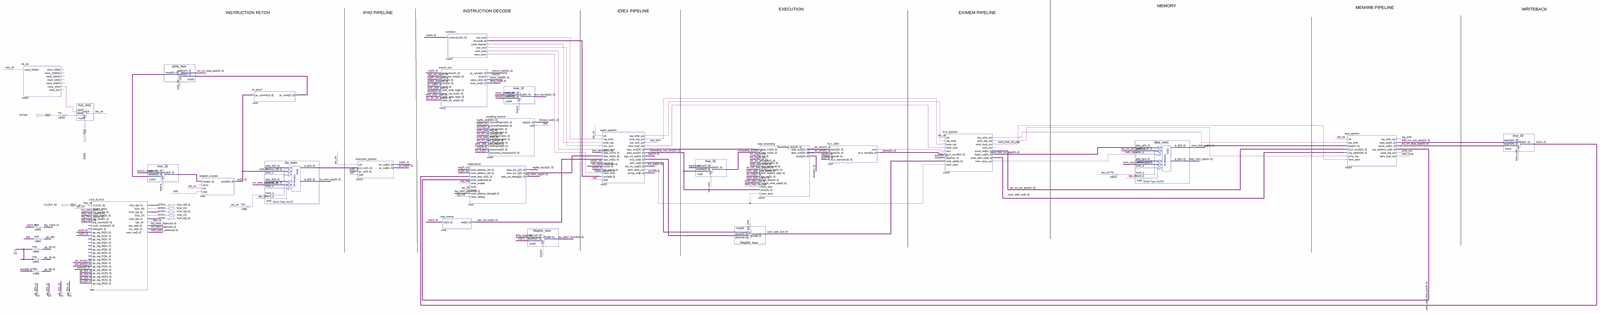
[diagram p0: schematic sheet, whole]
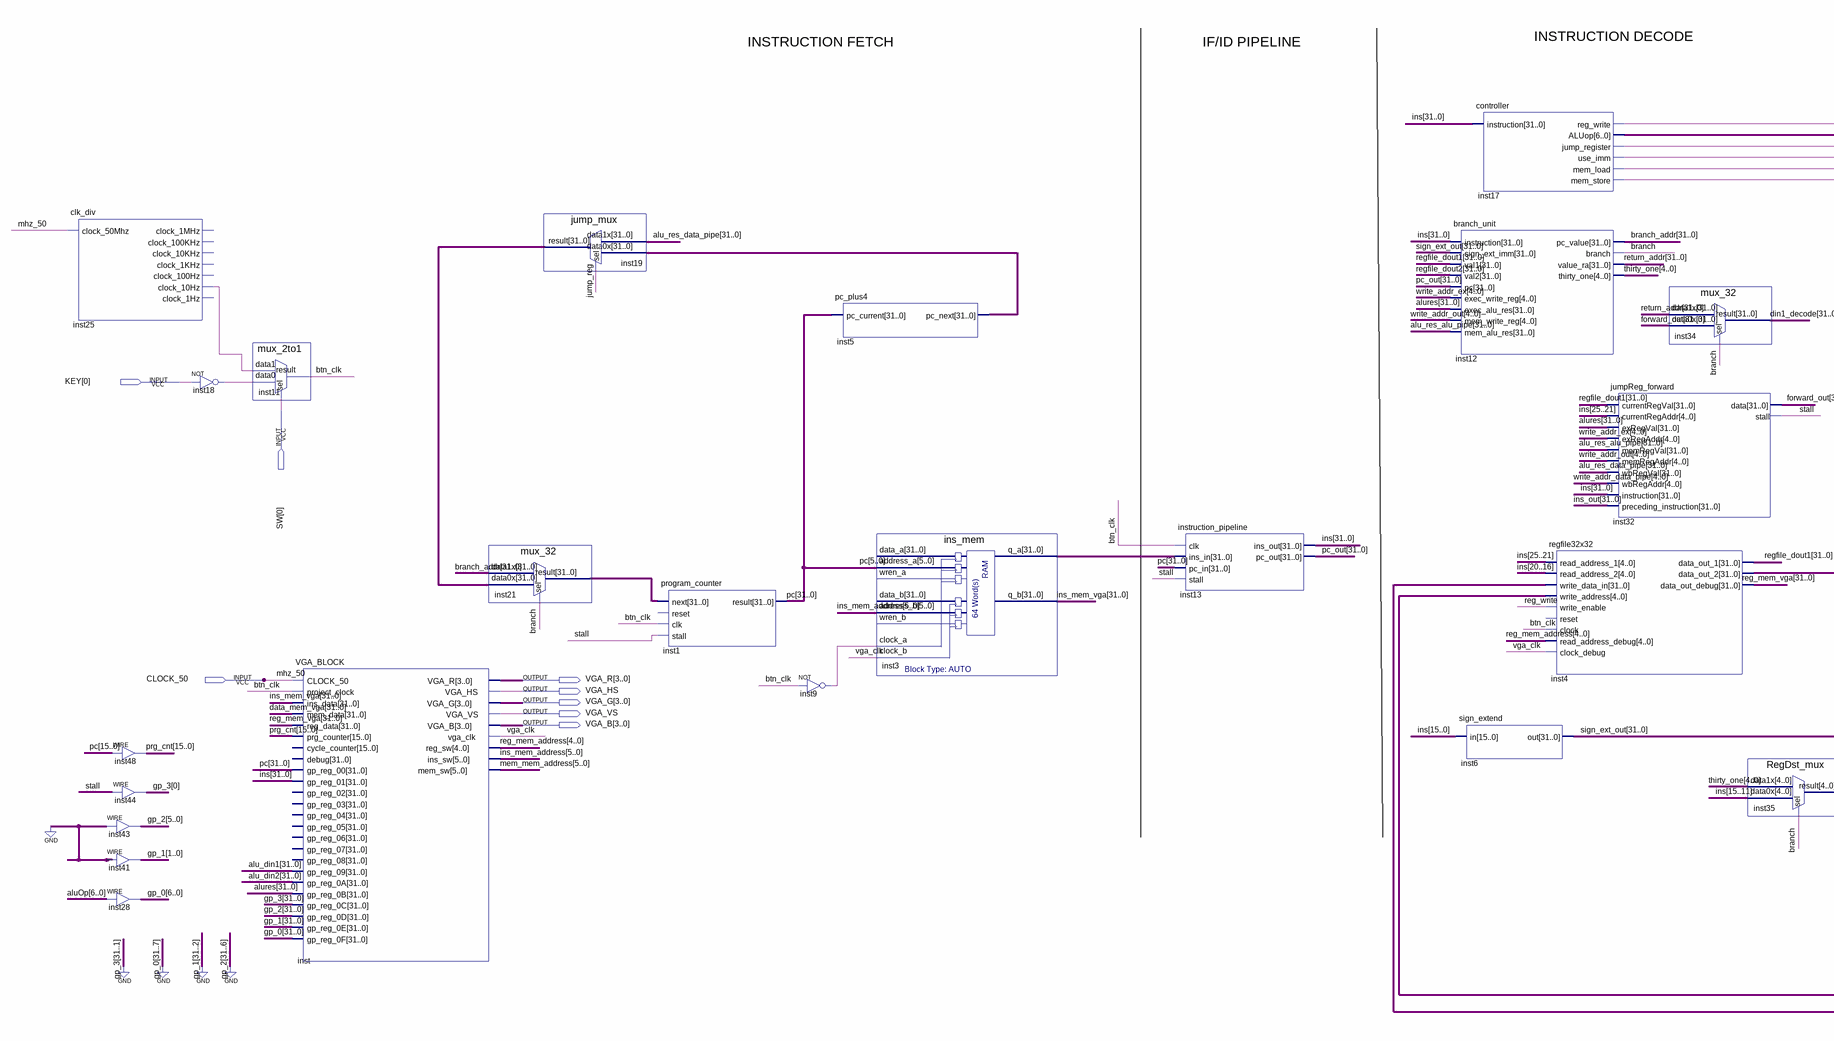
[diagram p1: schematic sheet, left part]
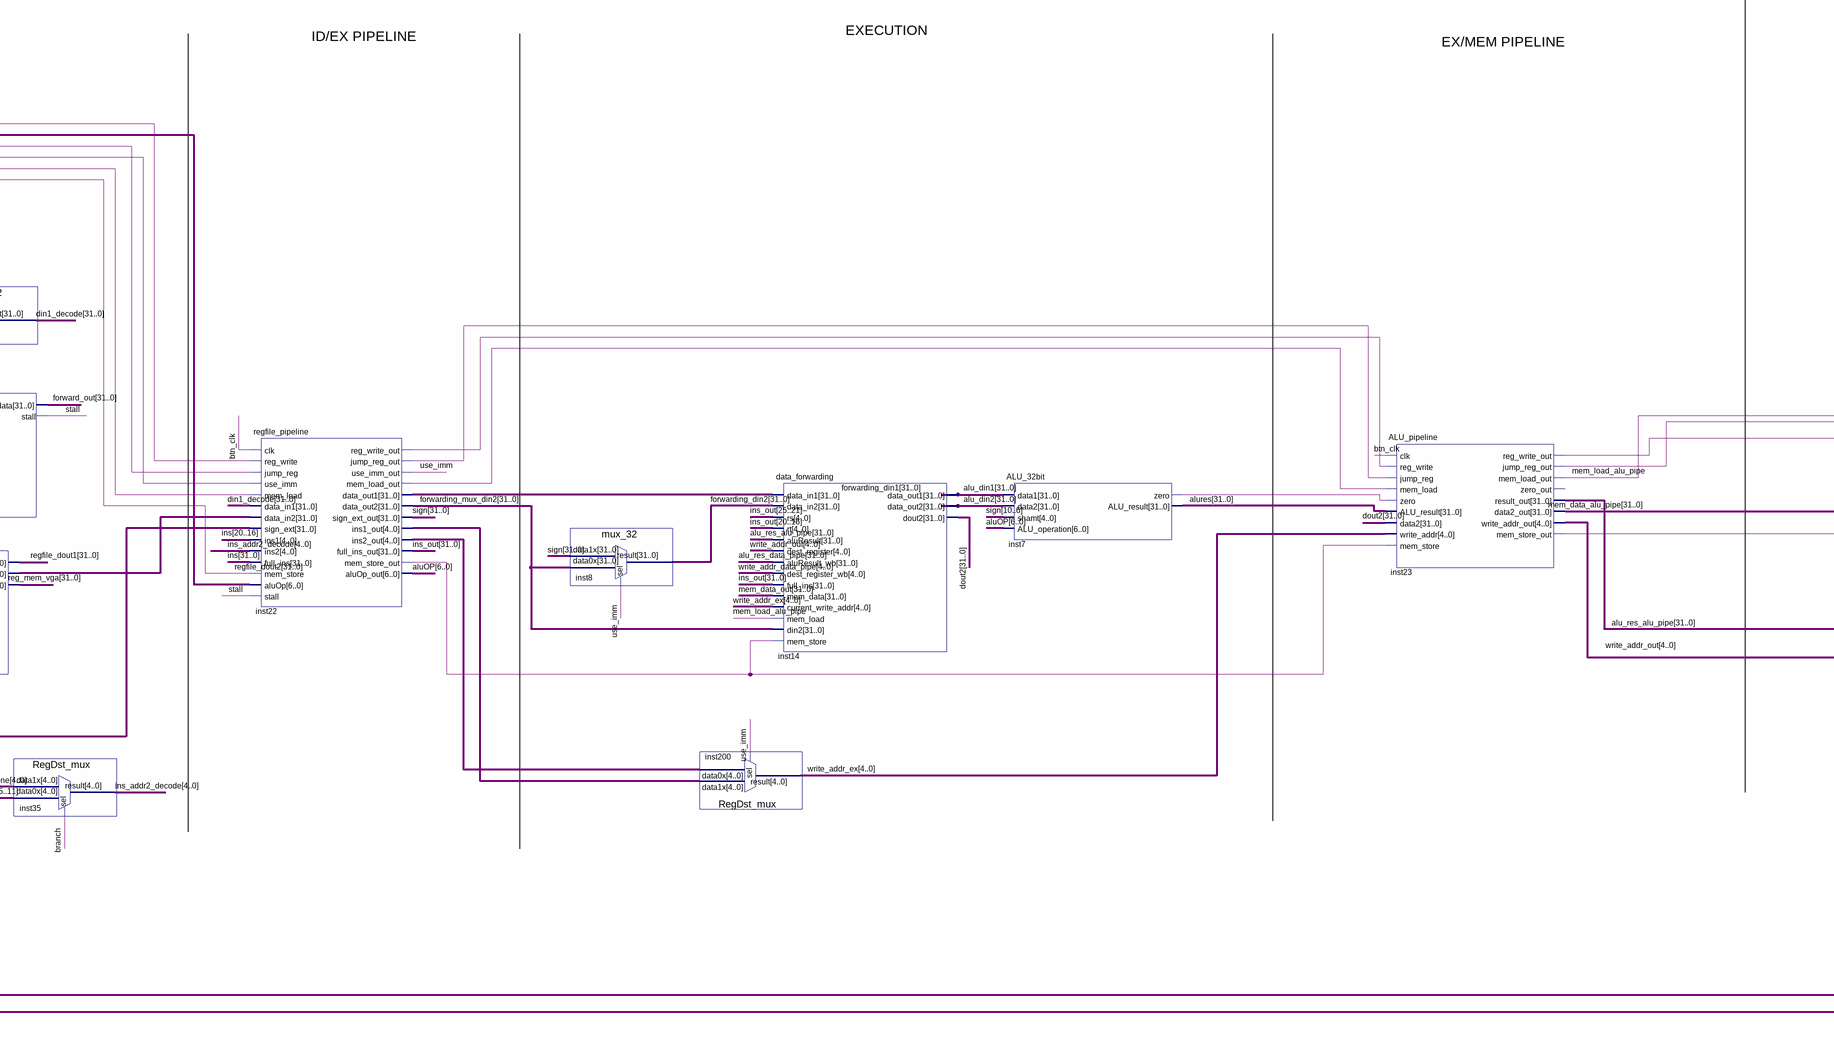
[diagram p2: schematic sheet, centre part]
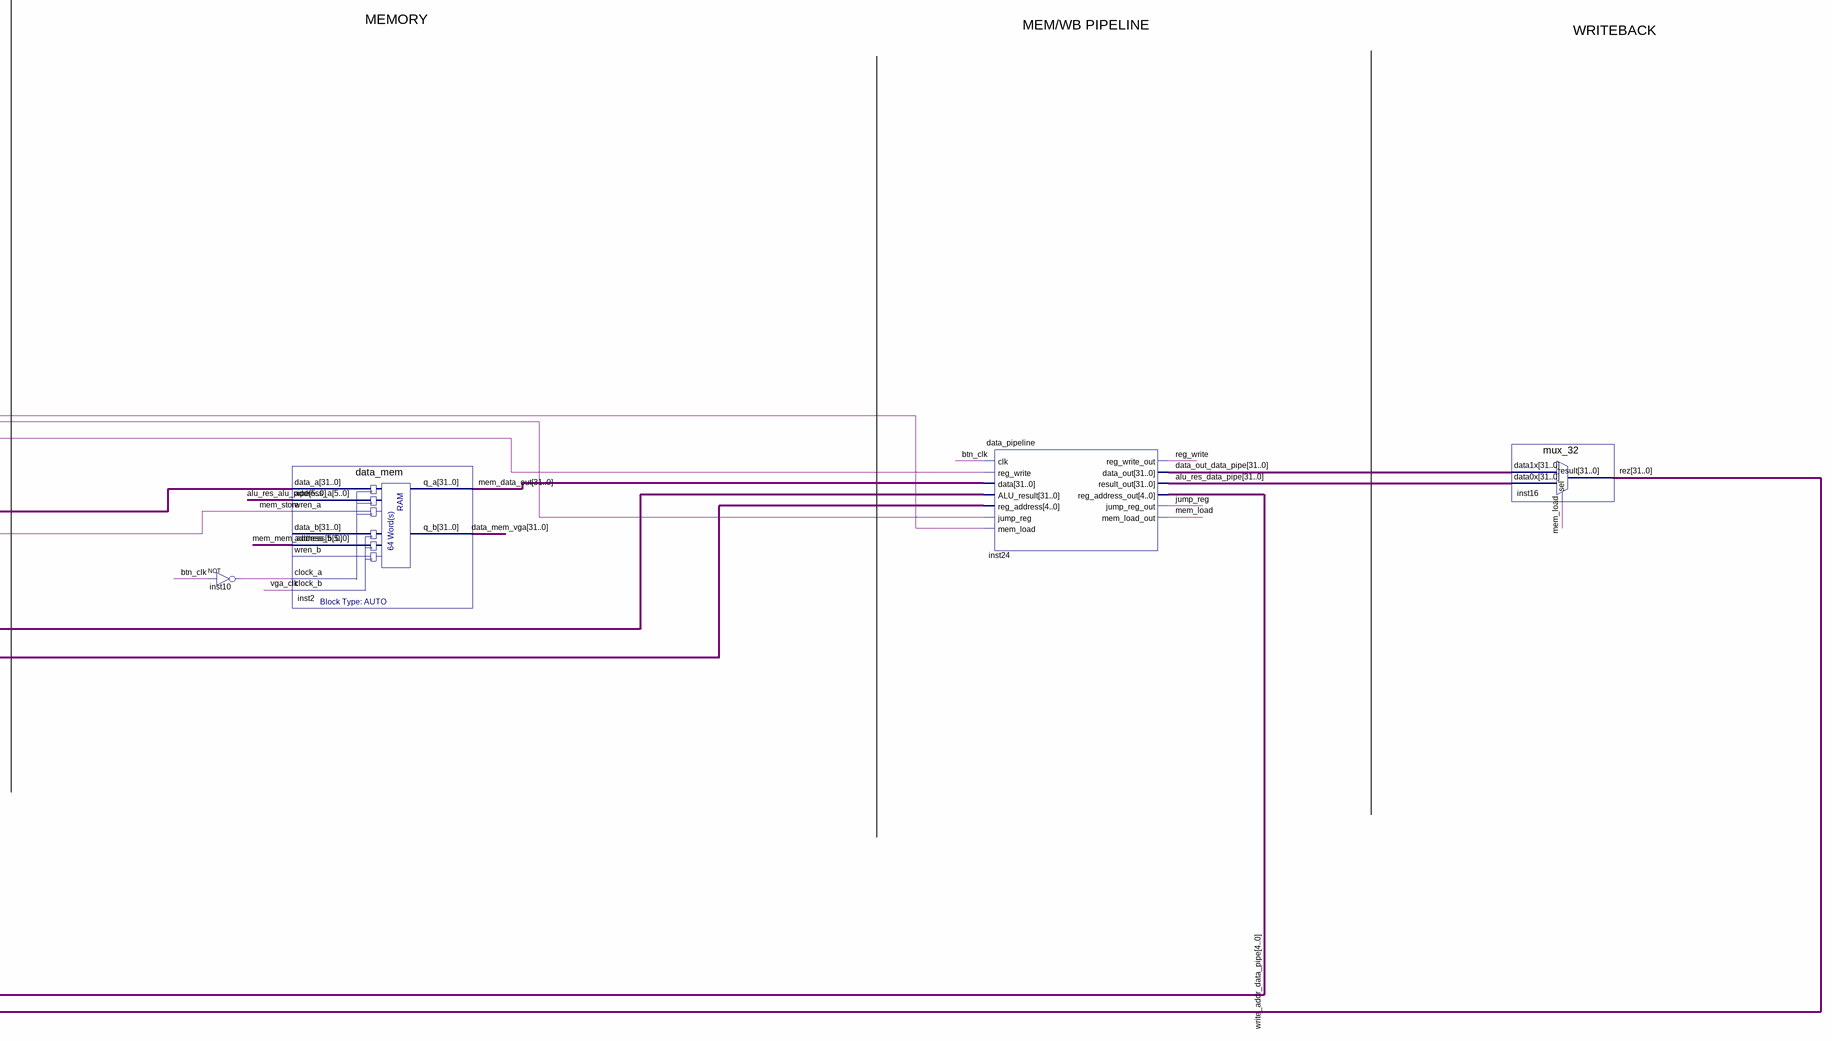
[diagram p3: schematic sheet, right part]
// Quartus schematic MIPS_PipelinedCPU.bdf as structural Verilog: 33 symbols, 8 pins
module MIPS_PipelinedCPU (
  input  [0:0] KEY,
  input  [0:0] SW,
  input  CLOCK_50,
  output [3:0] VGA_R,
  output VGA_HS,
  output [3:0] VGA_G,
  output VGA_VS,
  output [3:0] VGA_B
);

  wire branch, btn_clk, inst7_zero, inst9_out, inst10_out, inst17_jump_register, inst17_mem_load,
       inst17_mem_store, inst17_reg_write, inst17_use_imm, inst18_out, inst22_jump_reg_out,
       inst22_mem_load_out, inst22_mem_store_out, inst22_reg_write_out, inst23_jump_reg_out,
       inst23_reg_write_out, inst25_clock_10hz, jump_reg, mem_load, mem_load_alu_pipe, mem_store, reg_write,
       stall, use_imm, vga_clk;
  wire [0:0] gp_3;
  wire [1:0] gp_1;
  wire [4:0] ins_addr2_decode, inst22_ins1_out, inst22_ins2_out, reg_mem_address, thirty_one,
       write_addr_data_pipe, write_addr_ex, write_addr_out;
  wire [5:0] gp_2, ins_mem_address, mem_mem_address;
  wire [6:0] aluOP, gp_0, inst17_aluop;
  wire [15:0] prg_cnt;
  wire [31:0] alu_din1, alu_din2, alu_res_alu_pipe, alu_res_data_pipe, alures, branch_addr, data_mem_vga,
       data_out_data_pipe, din1_decode, dout2, forward_out, forwarding_din1, forwarding_din2,
       forwarding_mux_din2, ins, ins_mem_vga, ins_out, inst3_q_a, inst5_pc_next, inst19_result,
       inst21_result, mem_data_alu_pipe, mem_data_out, pc, pc_out, reg_mem_vga, regfile_dout1, regfile_dout2,
       return_addr, rez, sign, sign_ext_out;

  clk_div inst25 (
    .clock_50Mhz(CLOCK_50), .clock_10Hz(inst25_clock_10hz));  // open: clock_1MHz, clock_100KHz, clock_10KHz, clock_1KHz, clock_100Hz, clock_1Hz
  assign prg_cnt = pc[15:0];  // WIRE inst48
  assign gp_3[0] = stall;  // WIRE inst44
  assign gp_2 = {6{1'b0}};  // WIRE inst43
  assign gp_1 = {6{1'b0}};  // WIRE inst41
  assign gp_0 = aluOP;  // WIRE inst28
  not inst18 (inst18_out, KEY[0]);
  mux_2to1 inst11 (.data1(inst25_clock_10hz), .data0(inst18_out), .sel(SW[0]), .result(btn_clk));
  VGA_BLOCK inst (
    .CLOCK_50(CLOCK_50), .project_clock(btn_clk), .ins_data(ins_mem_vga), .mem_data(data_mem_vga),
    .reg_data(reg_mem_vga), .prg_counter(prg_cnt), .gp_reg_00(pc), .gp_reg_01(ins), .gp_reg_09(alu_din1),
    .gp_reg_0A(alu_din2), .gp_reg_0B(alures), .gp_reg_0C({{31{1'b0}}, gp_3[0]}),
    .gp_reg_0D({{26{1'b0}}, gp_2}), .gp_reg_0E({{30{1'b0}}, gp_1}), .gp_reg_0F({{25{1'b0}}, gp_0}),
    .VGA_R(VGA_R), .VGA_HS(VGA_HS), .VGA_G(VGA_G), .VGA_VS(VGA_VS), .VGA_B(VGA_B), .vga_clk(vga_clk),
    .reg_sw(reg_mem_address), .ins_sw(ins_mem_address), .mem_sw(mem_mem_address));  // open: cycle_counter, debug, gp_reg_02, gp_reg_03, gp_reg_04, gp_reg_05, gp_reg_06, gp_reg_07, gp_reg_08
  mux_32 inst21 (.data1x(branch_addr), .data0x(inst19_result), .sel(branch), .result(inst21_result));
  jump_mux inst19 (.data1x(alu_res_data_pipe), .data0x(inst5_pc_next), .sel(jump_reg), .result(inst19_result));
  program_counter inst1 (.next(inst21_result), .clk(btn_clk), .stall(stall), .result(pc));  // open: reset
  not inst9 (inst9_out, btn_clk);
  pc_plus4 inst5 (.pc_current(pc), .pc_next(inst5_pc_next));
  ins_mem inst3 (
    .address_a(pc[5:0]), .address_b(ins_mem_address), .clock_a(inst9_out), .clock_b(vga_clk),
    .q_a(inst3_q_a), .q_b(ins_mem_vga));  // open: data_a, wren_a, data_b, wren_b
  instruction_pipeline inst13 (
    .clk(btn_clk), .ins_in(inst3_q_a), .pc_in(pc), .stall(stall), .ins_out(ins), .pc_out(pc_out));
  controller inst17 (
    .instruction(ins), .reg_write(inst17_reg_write), .ALUop(inst17_aluop),
    .jump_register(inst17_jump_register), .use_imm(inst17_use_imm), .mem_load(inst17_mem_load),
    .mem_store(inst17_mem_store));
  branch_unit inst12 (
    .instruction(ins), .sign_ext_imm(sign_ext_out), .val1(regfile_dout1), .val2(regfile_dout2), .pc(pc_out),
    .exec_write_reg(write_addr_ex), .exec_alu_res(alures), .mem_write_reg(write_addr_out),
    .mem_alu_res(alu_res_alu_pipe), .pc_value(branch_addr), .branch(branch), .value_ra(return_addr),
    .thirty_one(thirty_one));
  sign_extend inst6 (.in(ins[15:0]), .out(sign_ext_out));
  regfile32x32 inst4 (
    .read_address_1(ins[25:21]), .read_address_2(ins[20:16]), .write_data_in(rez),
    .write_address(write_addr_data_pipe), .write_enable(reg_write), .clock(btn_clk),
    .read_address_debug(reg_mem_address), .clock_debug(vga_clk), .data_out_1(regfile_dout1),
    .data_out_2(regfile_dout2), .data_out_debug(reg_mem_vga));  // open: reset
  jumpReg_forward inst32 (
    .currentRegVal(regfile_dout1), .currentRegAddr(ins[25:21]), .exRegVal(alures), .exRegAddr(write_addr_ex),
    .memRegVal(alu_res_alu_pipe), .memRegAddr(write_addr_out), .wbRegVal(alu_res_data_pipe),
    .wbRegAddr(write_addr_data_pipe), .instruction(ins), .preceding_instruction(ins_out), .data(forward_out),
    .stall(stall));
  mux_32 inst34 (.data1x(return_addr), .data0x(forward_out), .sel(branch), .result(din1_decode));
  RegDst_mux inst35 (.data1x(thirty_one), .data0x(ins[15:11]), .sel(branch), .result(ins_addr2_decode));
  regfile_pipeline inst22 (
    .clk(btn_clk), .reg_write(inst17_reg_write), .jump_reg(inst17_jump_register), .use_imm(inst17_use_imm),
    .mem_load(inst17_mem_load), .data_in1(din1_decode), .data_in2(regfile_dout2), .sign_ext(sign_ext_out),
    .ins1(ins[20:16]), .ins2(ins_addr2_decode), .full_ins(ins), .mem_store(inst17_mem_store),
    .aluOp(inst17_aluop), .stall(stall), .reg_write_out(inst22_reg_write_out),
    .jump_reg_out(inst22_jump_reg_out), .use_imm_out(use_imm), .mem_load_out(inst22_mem_load_out),
    .data_out1(forwarding_din1), .data_out2(forwarding_mux_din2), .sign_ext_out(sign),
    .ins1_out(inst22_ins1_out), .ins2_out(inst22_ins2_out), .full_ins_out(ins_out),
    .mem_store_out(inst22_mem_store_out), .aluOp_out(aluOP));
  mux_32 inst8 (.data1x(sign), .data0x(forwarding_mux_din2), .sel(use_imm), .result(forwarding_din2));
  RegDst_mux inst200 (.data1x(inst22_ins1_out), .data0x(inst22_ins2_out), .sel(use_imm), .result(write_addr_ex));
  data_forwarding inst14 (
    .data_in1(forwarding_din1), .data_in2(forwarding_din2), .rs(ins_out[25:21]), .rt(ins_out[20:16]),
    .aluResult(alu_res_alu_pipe), .dest_register(write_addr_out), .aluResult_wb(alu_res_data_pipe),
    .dest_register_wb(write_addr_data_pipe), .full_ins(ins_out), .mem_data(mem_data_out),
    .current_write_addr(write_addr_ex), .mem_load(mem_load_alu_pipe), .din2(forwarding_mux_din2),
    .mem_store(inst22_mem_store_out), .data_out1(alu_din1), .data_out2(alu_din2), .dout2(dout2));
  ALU_32bit inst7 (
    .data1(alu_din1), .data2(alu_din2), .shamt(sign[10:6]), .ALU_operation(aluOP), .zero(inst7_zero),
    .ALU_result(alures));
  ALU_pipeline inst23 (
    .clk(btn_clk), .reg_write(inst22_reg_write_out), .jump_reg(inst22_jump_reg_out),
    .mem_load(inst22_mem_load_out), .zero(inst7_zero), .ALU_result(alures), .data2(dout2),
    .write_addr(write_addr_ex), .mem_store(inst22_mem_store_out), .reg_write_out(inst23_reg_write_out),
    .jump_reg_out(inst23_jump_reg_out), .mem_load_out(mem_load_alu_pipe), .result_out(alu_res_alu_pipe),
    .data2_out(mem_data_alu_pipe), .write_addr_out(write_addr_out), .mem_store_out(mem_store));  // open: zero_out
  not inst10 (inst10_out, btn_clk);
  data_mem inst2 (
    .data_a(mem_data_alu_pipe), .address_a(alu_res_alu_pipe[5:0]), .wren_a(mem_store),
    .address_b(mem_mem_address), .clock_a(inst10_out), .clock_b(vga_clk), .q_a(mem_data_out),
    .q_b(data_mem_vga));  // open: data_b, wren_b
  data_pipeline inst24 (
    .clk(btn_clk), .reg_write(inst23_reg_write_out), .data(mem_data_out), .ALU_result(alu_res_alu_pipe),
    .reg_address(write_addr_out), .jump_reg(inst23_jump_reg_out), .mem_load(mem_load_alu_pipe),
    .reg_write_out(reg_write), .data_out(data_out_data_pipe), .result_out(alu_res_data_pipe),
    .reg_address_out(write_addr_data_pipe), .jump_reg_out(jump_reg), .mem_load_out(mem_load));
  mux_32 inst16 (.data1x(data_out_data_pipe), .data0x(alu_res_data_pipe), .sel(mem_load), .result(rez));

  // Other names for the same wires on the sheet: mhz_50 = CLOCK_50

  // Notes on the sheet:
  //   MEMORY
  //   MEM/WB PIPELINE
  //   EXECUTION
  //   WRITEBACK
  //   INSTRUCTION DECODE
  //   ID/EX PIPELINE
  //   INSTRUCTION FETCH
  //   IF/ID PIPELINE
  //   EX/MEM PIPELINE
endmodule
